# EAGLE design BUZZI-08 (EAGLE 4.15)
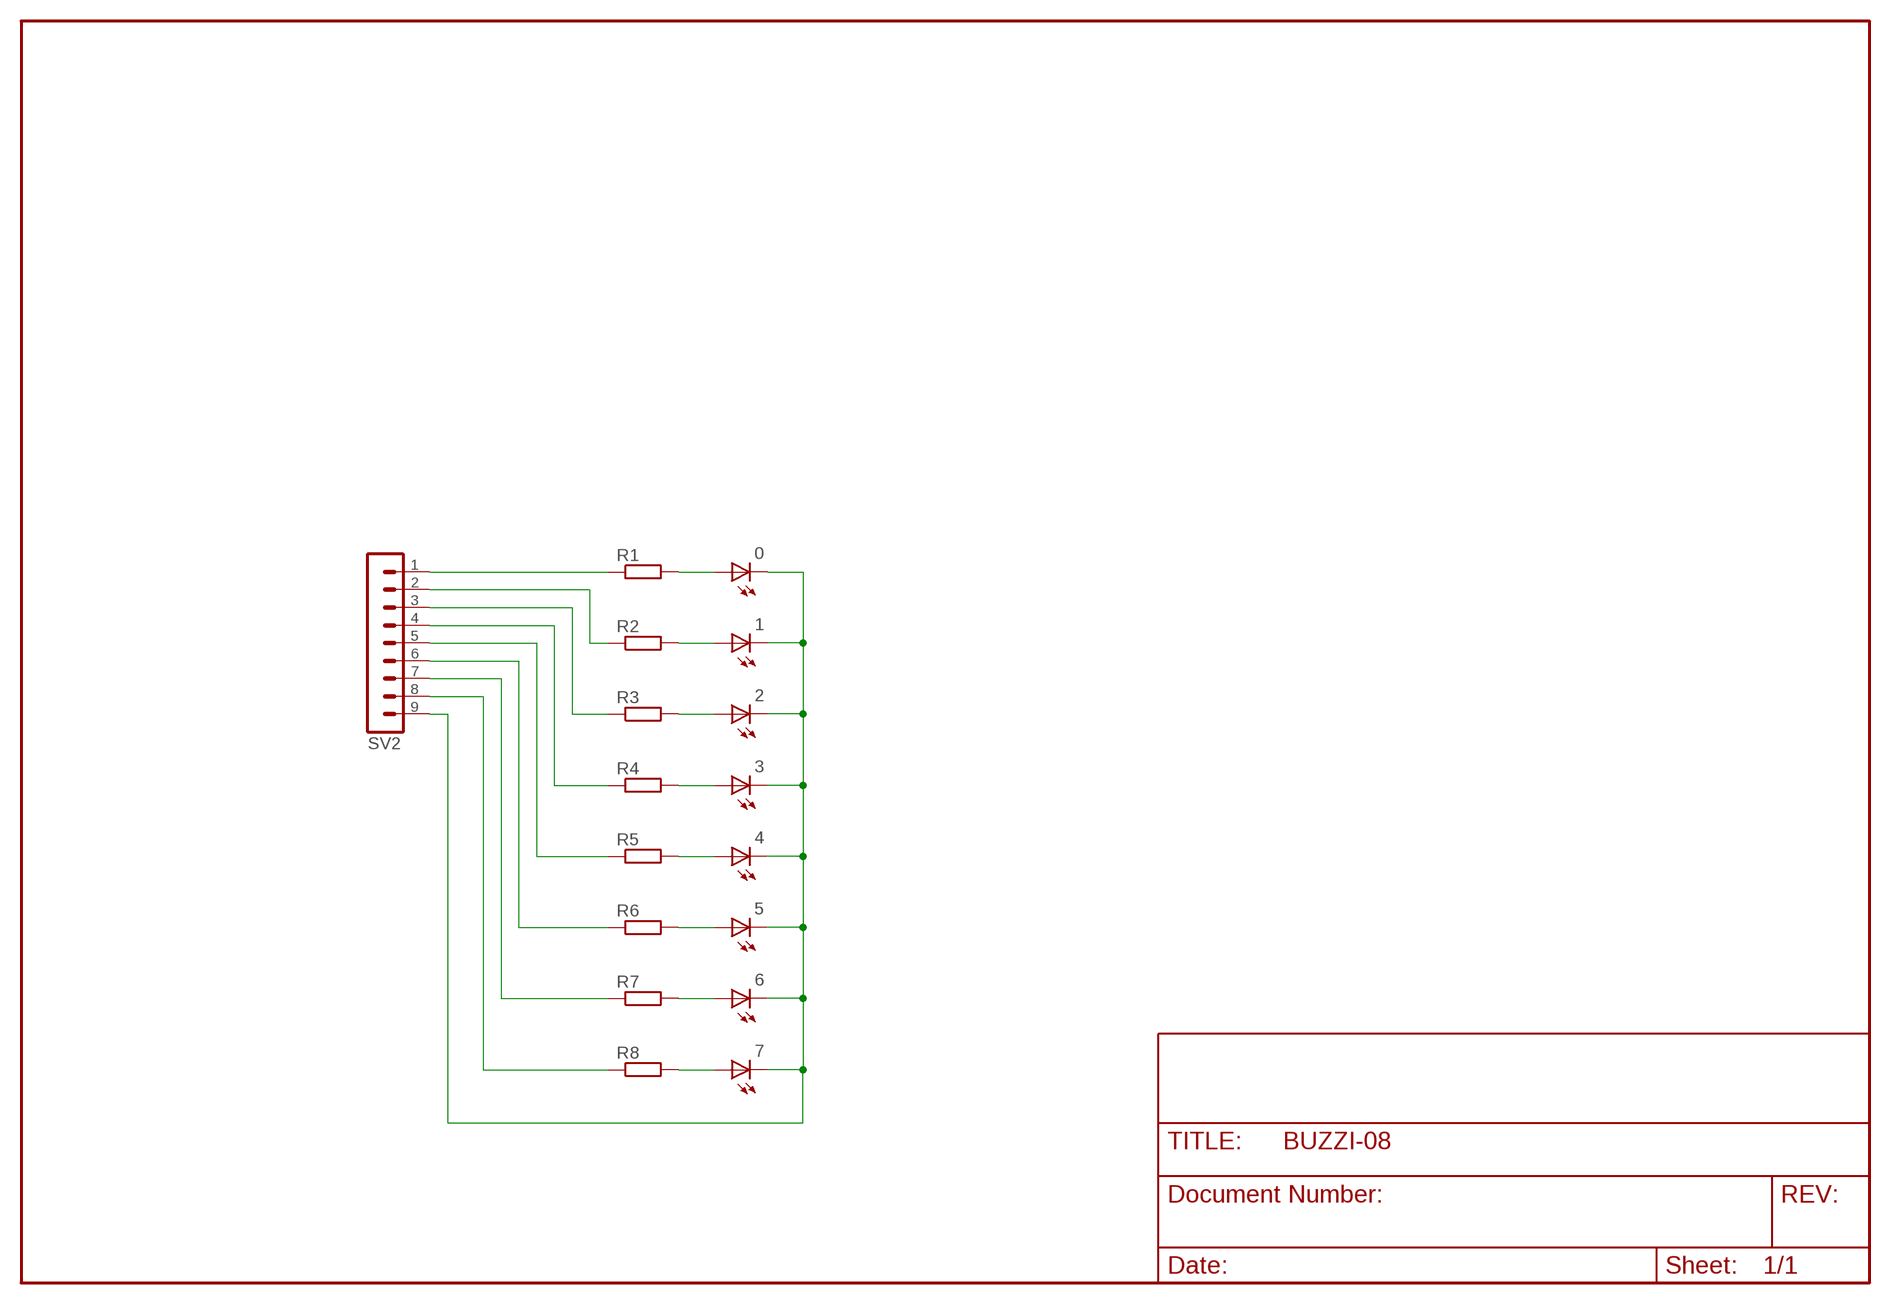
[diagram p0: schematic, sheet 1]

## Parts
0  LEDCHIPLED_0805  [CHIPLED_0805]
1  LEDCHIPLED_0805  [CHIPLED_0805]
2  LEDCHIPLED_0805  [CHIPLED_0805]
3  LEDCHIPLED_0805  [CHIPLED_0805]
4  LEDCHIPLED_0805  [CHIPLED_0805]
5  LEDCHIPLED_0805  [CHIPLED_0805]
6  LEDCHIPLED_0805  [CHIPLED_0805]
7  LEDCHIPLED_0805  [CHIPLED_0805]
R1  R-EU_R0805  [R0805]
R2  R-EU_R0805  [R0805]
R3  R-EU_R0805  [R0805]
R4  R-EU_R0805  [R0805]
R5  R-EU_R0805  [R0805]
R6  R-EU_R0805  [R0805]
R7  R-EU_R0805  [R0805]
R8  R-EU_R0805  [R0805]
SV2  MA09-1  [MA09-1]

## Nets
N$1: R1.1 SV2.1
N$2: R2.1 SV2.2
N$3: R3.1 SV2.3
N$4: R4.1 SV2.4
N$5: R5.1 SV2.5
N$6: R6.1 SV2.6
N$7: R7.1 SV2.7
N$8: R8.1 SV2.8
N$9: 0.A R1.2
N$10: 1.A R2.2
N$11: 2.A R3.2
N$12: 3.A R4.2
N$13: 4.A R5.2
N$14: 5.A R6.2
N$15: 6.A R7.2
N$16: 7.A R8.2
N$18: 0.C 1.C 2.C 3.C 4.C 5.C 6.C 7.C SV2.9

## Library data of the parts
0 1-7 = led:LED: LED OSRAM: - CHIPLED LG R971, LG N971, LY N971, LG Q971, LY Q971, LO R971, LY R971 LH N974, LH R974 LS Q976, LO Q976, LY Q976 LO Q996 - Hyper CHIPLED LW Q18S LB Q993, LB Q99A, LB R99A - SideLED LS A670, LO A670, LY A670, LG A670, LP A670 LB A673, LV A673, LT A673, LW A673 LH A674 LY A675 LS A676, LA A676, LO A676, LY A676, LW A676 LS A679, LY A679, LG A679 - Hyper Micro SIDELED® LS Y876, LA Y876, LO Y876, LY Y876 LT Y87S - SmartLED LW L88C, LW L88S LB L89C, LB L89S, LG L890 LS L89K, LO L89K, LY L89K LS L896, LA L896, LO L896, LY L896 - TOPLED LS T670, LO T670, LY T670, LG T670, LP T670 LSG T670, LSP T670, LSY T670, LOP T670, LYG T670 LG T671, LOG T671, LSG T671 LB T673, LV T673, LT T673, LW T673 LH T674 LS T676, LA T676, LO T676, LY T676, LB T676, LH T676, LSB T676, LW T676 LB T67C, LV T67C, LT T67C, LS T67K, LO T67K, LY T67K, LW E67C LS E67B, LA E67B, LO E67B, LY E67B, LB E67C, LV E67C, LT E67C LW T67C LS T679, LY T679, LG T679 LS T770, LO T770, LY T770, LG T770, LP T770 LB T773, LV T773, LT T773, LW T773 LH T774 LS E675, LA E675, LY E675, LS T675 LS T776, LA T776, LO T776, LY T776, LB T776 LHGB T686 LT T68C, LB T68C - Hyper Mini TOPLED® LB M676 - Mini TOPLED Santana® LG M470 LS M47K, LO M47K, LY M47K Source: http://www.osram.convergy.de/
R1-R8 = rcl:R-EU_: RESISTOR, European symbol
SV2 = con-lstb:MA09-1: PIN HEADER

## Board
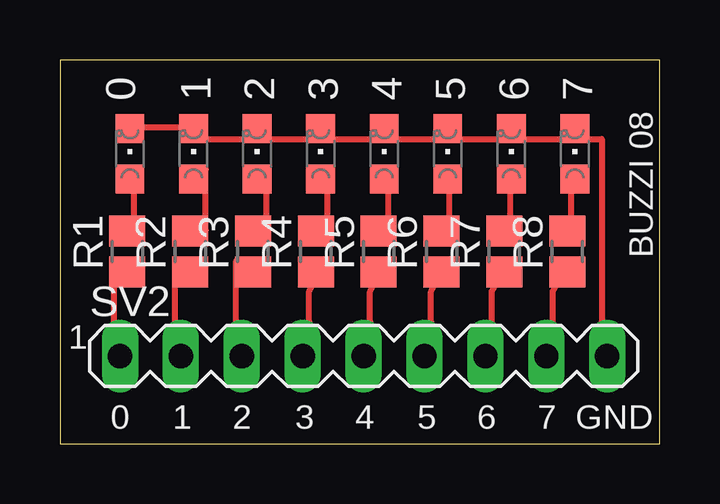
[diagram p1: board, top side]

Size 25 x 16 mm. Coordinates in mm from the lower left corner, seen from the top.
Outline: 0,0 25,0 25,16 0,16 0,0
Copper layers (1*16): Top 0.035mm / dielectric 1.5mm / Bottom 0.035mm
Design rules "default": minimum track width 10mil, minimum drill 24mil, track to track 8mil, track to pad 8mil, pad to pad 8mil, via to via 8mil, smd to smd 8mil, copper to edge 40mil, drill to drill 8mil, minimum pad ring 10mil, minimum via ring 8mil, stop-mask expansion 4mil, vias tented up to drill 0mil, thermal gap 10mil

### Footprints (pad centres in the part's own frame; a part is rotated, then mirrored left to right if it is on the bottom)
CHIPLED_0805 = smd 1.2 x 1.2: A 0,-1.05; C 0,1.05
R0805 = smd 1.3 x 1.5: 1 -0.85,0; 2 0.85,0
MA09-1 = drill 1.016 long: 1 -10.16,0; 2 -7.62,0; 3 -5.08,0; 4 -2.54,0; 5 0,0; 6 2.54,0; 7 5.08,0; 8 7.62,0; 9 10.16,0

### Placement (x,y rotation side)
0  2.92,12.08 0 top
1  5.57,12.08 0 top
2  8.22,12.08 0 top
3  10.87,12.08 0 top
4  13.52,12.08 0 top
5  16.17,12.08 0 top
6  18.82,12.08 0 top
7  21.47,12.08 0 top
R1  2.81,8.01 90 top
R2  5.43,8.01 90 top
R3  8.05,8.01 90 top
R4  10.67,8.01 90 top
R5  13.29,8.01 90 top
R6  15.91,8.01 90 top
R7  18.53,8.01 90 top
R8  21.15,8.01 90 top
SV2  12.66,3.65 0 top

### Tracks (layer width: path | path; a pad name or v marks a point on that pad's centre or on a via)
N$1
  Top 0.254: R1.1 2.27,7.62 2.27,5.08 SV2.1
N$2
  Top 0.254: R2.1 4.81,7.62 4.81,5.08 SV2.2
N$3
  Top 0.254: R3.1 7.35,7.62 7.35,5.08 SV2.3
N$4
  Top 0.254: R4.1 11.16,7.62 10.39,6.35 10.39,5.08 SV2.4
N$5
  Top 0.254: R5.1 13.7,7.62 12.93,6.35 12.93,5.08 SV2.5
N$6
  Top 0.254: R6.1 16.24,7.62 15.47,6.35 15.47,5.08 SV2.6
N$7
  Top 0.254: R7.1 18.78,7.62 18.01,6.35 18.01,5.08 SV2.7
N$8
  Top 0.254: R8.1 21.32,7.62 20.55,6.35 20.55,5.08 SV2.8
N$9
  Top 0.254: 0.A 3.1,10.5 3.1,9.3 R1.2
N$10
  Top 0.254: 1.A 6.08,11.43 6.08,8.89 R2.2
N$11
  Top 0.254: 2.A 8.62,11.43 8.62,8.89 R3.2
N$12
  Top 0.254: 3.A 11.16,11.43 11.16,8.89 R4.2
N$13
  Top 0.254: 4.A 13.7,11.43 13.7,8.89 R5.2
N$14
  Top 0.254: 5.A 16.24,11.43 16.24,8.89 R6.2
N$15
  Top 0.254: 6.A 18.78,11.43 18.78,8.89 R7.2
N$16
  Top 0.254: 7.A 21.32,11.43 21.32,8.89 R8.2
N$18
  Top 0.254: 8.62,12.7 6.08,12.7 1.C 5.2,13.2 3.4,13.2 0.C | 8.62,12.7 11.16,12.7 | 8.62,12.7 2.C | 11.16,12.7 13.7,12.7 | 11.16,12.7 3.C | 13.7,12.7 16.24,12.7 | 13.7,12.7 4.C | 16.24,12.7 18.78,12.7 | 16.24,12.7 5.C | 18.78,12.7 21.32,12.7 | 18.78,12.7 6.C | 21.32,12.7 22.59,12.7 22.59,5.08 SV2.9 | 21.32,12.7 7.C

### Text on the board
tPlace: BUZZI 08 | 0 | 1 | 2 | 3 | 4 | 5 | 6 | 7 | GND